# EAGLE schematic mmcaudio-analog-in (EAGLE 6.5.0)
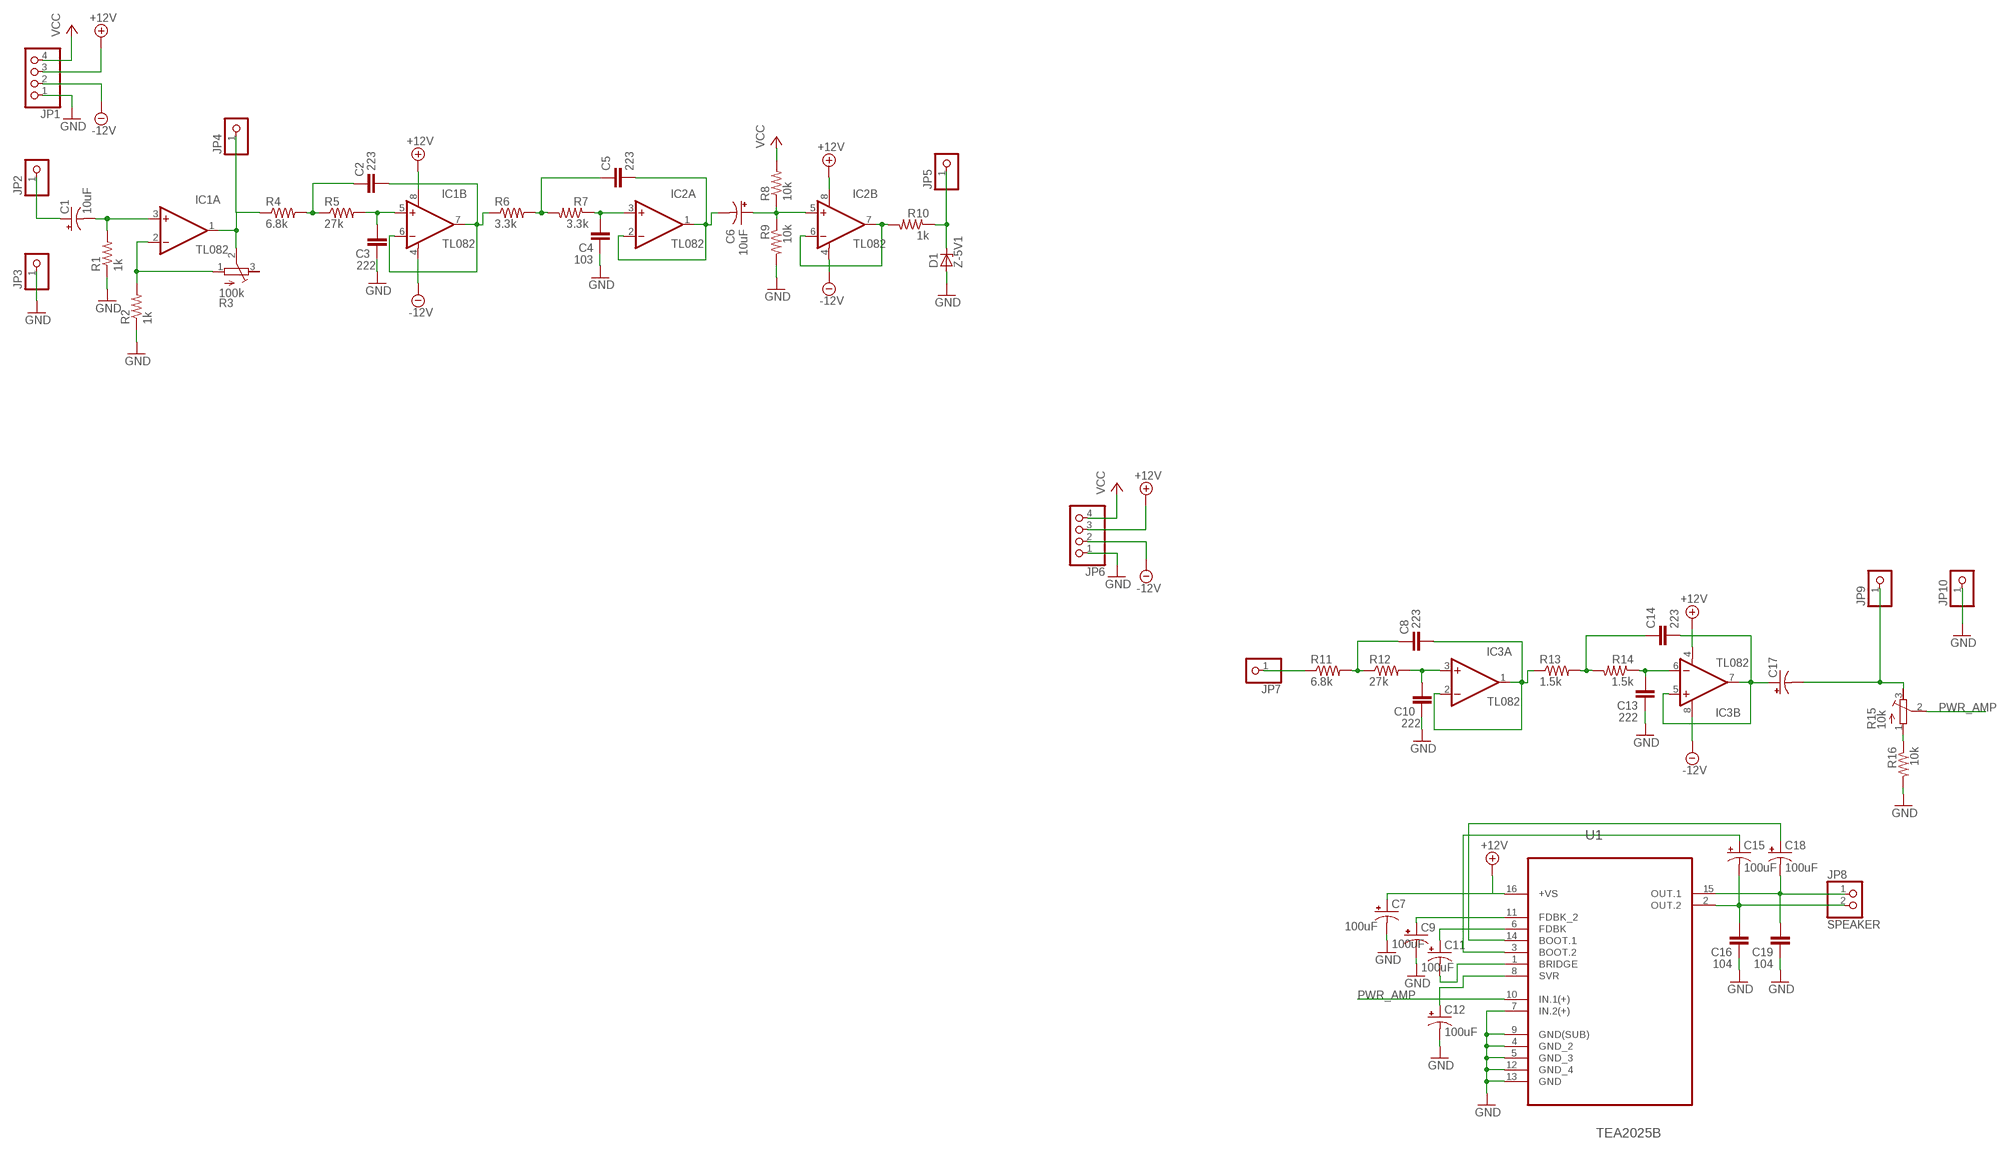
[diagram p0: schematic, sheet 1]

## Parts
C1  10uF  CPOL-USSANYO_D  [POL-CAP-COMMON]
C2  223  C-EUCERAMIC-CAP-COMMON  [C025-060X050]
C3  222  C-EUCERAMIC-CAP-COMMON  [C025-060X050]
C4  103  C-EUCERAMIC-CAP-COMMON  [C025-060X050]
C5  223  C-EUCERAMIC-CAP-COMMON  [C025-060X050]
C6  10uF  CPOL-USSANYO_D  [POL-CAP-COMMON]
C7  100uF  CPOL-USSANYO_D  [POL-CAP-COMMON]
C8  223  C-EUCERAMIC-CAP-COMMON  [C025-060X050]
C9  100uF  CPOL-USSANYO_D  [POL-CAP-COMMON]
C10  222  C-EUCERAMIC-CAP-COMMON  [C025-060X050]
C11  100uF  CPOL-USSANYO_D  [POL-CAP-COMMON]
C12  100uF  CPOL-USSANYO_D  [POL-CAP-COMMON]
C13  222  C-EUCERAMIC-CAP-COMMON  [C025-060X050]
C14  223  C-EUCERAMIC-CAP-COMMON  [C025-060X050]
C15  100uF  CPOL-USSANYO_D  [POL-CAP-COMMON]
C16  104  C-EUCERAMIC-CAP-COMMON  [C025-060X050]
C17  CPOL-USSANYO_D  [POL-CAP-COMMON]
C18  100uF  CPOL-USSANYO_D  [POL-CAP-COMMON]
C19  104  C-EUCERAMIC-CAP-COMMON  [C025-060X050]
D1  Z-5V1  [DO35Z7]
IC1  TL082  [DIP08]
IC2  TL082  [DIP08]
IC3  TL082  [DIP08]
JP1  PINHD-1X4  [1X04]
JP2  PINHD-1X1  [1X01]
JP3  PINHD-1X1  [1X01]
JP4  PINHD-1X1  [1X01]
JP5  PINHD-1X1  [1X01]
JP6  PINHD-1X4  [1X04]
JP7  PINHD-1X1  [1X01]
JP8  SPEAKER  PINHD-1X20.5"  [1X02/0.5"]
JP9  PINHD-1X1  [1X01]
JP10  PINHD-1X1  [1X01]
R1  1k  R-US_0207/10  [R-US-COMMON]
R2  1k  R-US_0207/10  [R-US-COMMON]
R3  100k  R-TRIMM64W  [RTRIM-COMMON]
R4  6.8k  R-US_0207/10  [R-US-COMMON]
R5  27k  R-US_0207/10  [R-US-COMMON]
R6  3.3k  R-US_0207/10  [R-US-COMMON]
R7  3.3k  R-US_0207/10  [R-US-COMMON]
R8  10k  R-US_0207/10  [R-US-COMMON]
R9  10k  R-US_0207/10  [R-US-COMMON]
R10  1k  R-US_0207/10  [R-US-COMMON]
R11  6.8k  R-US_0207/10  [R-US-COMMON]
R12  27k  R-US_0207/10  [R-US-COMMON]
R13  1.5k  R-US_0207/10  [R-US-COMMON]
R14  1.5k  R-US_0207/10  [R-US-COMMON]
R15  10k  R-TRIMM64W  [RTRIM-COMMON]
R16  10k  R-US_0207/10  [R-US-COMMON]
U1  TEA2025B  [DIP254P762X510-16]

## Nets
+12V: C7.+ IC1.8(B:V+) IC2.8(B:V+) IC3.4(B:V-) JP1.3 JP6.3 U1.16(+VS)
-12V: IC1.4(B:V-) IC2.4(B:V-) IC3.8(B:V+) JP1.2 JP6.2
GND: C3.1 C4.1 C7.- C9.- C10.1 C12.- C13.1 C16.1 C19.1 D1.A JP1.1 JP3.1 JP6.1 JP10.1 R1.1 R2.1 R9.2 R16.2 U1.4(GND_2) U1.5(GND_3) U1.7(IN.2(+)) U1.9(GND(SUB)) U1.12(GND_4) U1.13(GND)
N$1: C1.- IC1.3(A:+IN) R1.2
N$2: IC1.2(A:-IN) R2.2 R3.1(A)
N$3: IC1.1(A:OUT) JP4.1 R3.2(S) R4.1
N$4: C2.1 R4.2 R5.1
N$5: C3.2 IC1.5(B:+IN) R5.2
N$6: C2.2 IC1.6(B:-IN) IC1.7(B:OUT) R6.1
N$7: C5.1 R6.2 R7.2
N$8: C4.2 IC2.3(A:+IN) R7.1
N$9: C5.2 C6.- IC2.1(A:OUT) IC2.2(A:-IN)
N$10: C6.+ IC2.5(B:+IN) R8.1 R9.1
N$11: IC2.6(B:-IN) IC2.7(B:OUT) R10.2
N$12: D1.C JP5.1 R10.1
N$13: C1.+ JP2.1
N$14: C8.1 R11.2 R12.1
N$15: C10.2 IC3.3(A:+IN) R12.2
N$16: C8.2 IC3.1(A:OUT) IC3.2(A:-IN) R13.1
N$17: C14.1 R13.2 R14.2
N$18: C13.2 IC3.6(B:-IN) R14.1
N$19: C14.2 C17.+ IC3.5(B:+IN) IC3.7(B:OUT)
N$20: JP7.1 R11.1
N$21: C17.- JP9.1 R15.3(E)
N$22: C9.+ U1.11(FDBK_2)
N$23: C11.+ U1.6(FDBK)
N$24: C11.- U1.1(BRIDGE)
N$25: C18.- C19.2 JP8.1 U1.15(OUT.1)
N$26: C18.+ U1.14(BOOT.1)
N$27: C15.- C16.2 JP8.2 U1.2(OUT.2)
N$28: C15.+ U1.3(BOOT.2)
N$29: C12.+ U1.8(SVR)
N$30: R15.1(A) R16.1
PWR_AMP: R15.2(S) U1.10(IN.1(+))
VCC: JP1.4 JP6.4 R8.2
Unconnected: R3.3(E)

## Library data of the parts
C1 C6 C7 C9 C11 C12 C15 C17 C18 = datle-discrete:CPOL-US: POLARIZED CAPACITOR, American symbol
C2-C5 C8 C10 C13 C14 C16 C19 = datle-discrete:C-EU: CAPACITOR, European symbol
D1 = datle-discrete:Z-5V1
IC1-IC3 = datle-analogic:TL082
JP1 JP6 = pinhead:PINHD-1X4: PIN HEADER
JP2-JP5 JP7 JP9 JP10 = datle-conn:PINHD-1X1: PIN HEADER
JP8 = datle-conn:PINHD-1X2: PIN HEADER
R1 R2 R4-R14 R16 = datle-discrete:R-US_: RESISTOR, American symbol
R3 R15 = datle-discrete:R-TRIMM: Trimm resistor
U1 = datle-analogic:TEA2025B: STREO AUDIO AMPLIFIER; MPN: TEA2025B; OC_FARNELL: 1263004; OC_NEWARK: 89K1062; PACKAGE: PDIP-16; SUPPLIER: STMICROELECTRONICS